# EAGLE design 5x5 Led Matrix (EAGLE 7.1.0)
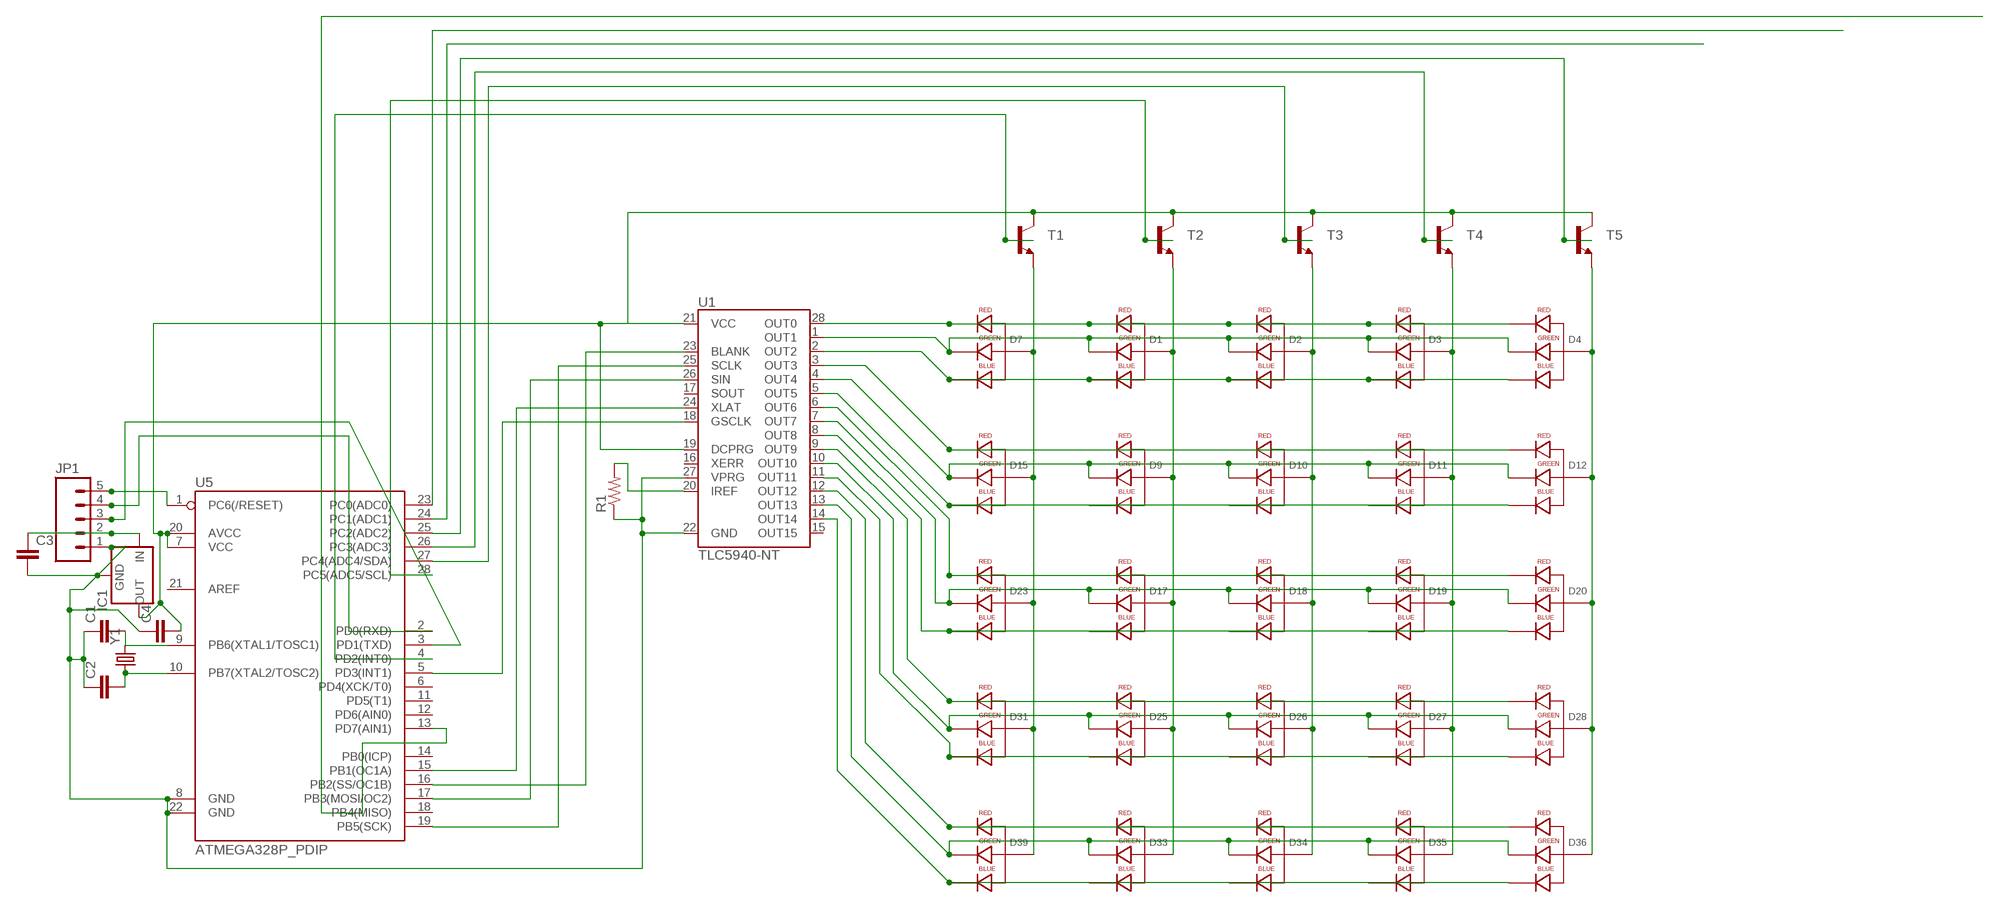
[diagram p0: schematic, sheet 1]

## Parts
C1  CAPPTH  [CAP-PTH-SMALL]
C2  CAPPTH  [CAP-PTH-SMALL]
C3  CAPPTH  [CAP-PTH-SMALL]
C4  CAPPTH  [CAP-PTH-SMALL]
D1  LED-RGB-CA-THRUDIFFUSE  [LED-RGB-THRU]
D2  LED-RGB-CA-THRUDIFFUSE  [LED-RGB-THRU]
D3  LED-RGB-CA-THRUDIFFUSE  [LED-RGB-THRU]
D4  LED-RGB-CA-THRUDIFFUSE  [LED-RGB-THRU]
D7  LED-RGB-CA-THRUCLEAR  [LED-RGB-THRU]
D9  LED-RGB-CA-THRUDIFFUSE  [LED-RGB-THRU]
D10  LED-RGB-CA-THRUDIFFUSE  [LED-RGB-THRU]
D11  LED-RGB-CA-THRUDIFFUSE  [LED-RGB-THRU]
D12  LED-RGB-CA-THRUDIFFUSE  [LED-RGB-THRU]
D15  LED-RGB-CA-THRUDIFFUSE  [LED-RGB-THRU]
D17  LED-RGB-CA-THRUDIFFUSE  [LED-RGB-THRU]
D18  LED-RGB-CA-THRUDIFFUSE  [LED-RGB-THRU]
D19  LED-RGB-CA-THRUDIFFUSE  [LED-RGB-THRU]
D20  LED-RGB-CA-THRUDIFFUSE  [LED-RGB-THRU]
D23  LED-RGB-CA-THRUDIFFUSE  [LED-RGB-THRU]
D25  LED-RGB-CA-THRUDIFFUSE  [LED-RGB-THRU]
D26  LED-RGB-CA-THRUDIFFUSE  [LED-RGB-THRU]
D27  LED-RGB-CA-THRUDIFFUSE  [LED-RGB-THRU]
D28  LED-RGB-CA-THRUCLEAR  [LED-RGB-THRU]
D31  LED-RGB-CA-THRUDIFFUSE  [LED-RGB-THRU]
D33  LED-RGB-CA-THRUDIFFUSE  [LED-RGB-THRU]
D34  LED-RGB-CA-THRUDIFFUSE  [LED-RGB-THRU]
D35  LED-RGB-CA-THRUDIFFUSE  [LED-RGB-THRU]
D36  LED-RGB-CA-THRUDIFFUSE  [LED-RGB-THRU]
D39  LED-RGB-CA-THRUDIFFUSE  [LED-RGB-THRU]
IC1  V_REG_78XXSIDE  [78XXL]
JP1  M05PTH  [1X05]
R1  RESISTORPTH-1/2W  [AXIAL-0.5]
T1  TRANSISTOR_NPN2N3904  [TO-92]
T2  TRANSISTOR_NPN2N3904  [TO-92]
T3  TRANSISTOR_NPN2N3904  [TO-92]
T4  TRANSISTOR_NPN2N3904  [TO-92]
T5  TRANSISTOR_NPN2N3904  [TO-92]
U1  TLC5940-NT  [DIL28-3]
U5  ATMEGA328P_PDIP  [DIL28-3]
Y1  CRYSTALHC49US  [HC49US]

## Nets
GND: C1.1 C2.1 C3.2 C4.1 IC1.GND JP1.1 R1.P$1 U1.22(GND) U1.27(VPRG) U5.8(GND) U5.22(GND)
N$1: D1.1(RED_CATHODE) D2.1(RED_CATHODE) D3.1(RED_CATHODE) D4.1(RED_CATHODE) D7.1(RED_CATHODE) U1.28(OUT0)
N$2: C1.2 U5.9(PB6(XTAL1/TOSC1)) Y1.2
N$3: C2.2 U5.10(PB7(XTAL2/TOSC2)) Y1.1
N$4: JP1.5 U5.1(PC6(/RESET))
N$5: JP1.4 U5.2(PD0(RXD))
N$6: JP1.3 U5.3(PD1(TXD))
N$10: D1.4(BLUE_CATHODE) D2.4(BLUE_CATHODE) D3.4(BLUE_CATHODE) D4.4(BLUE_CATHODE) D7.4(BLUE_CATHODE) U1.2(OUT2)
N$12: U1.25(SCLK) U5.19(PB5(SCK))
N$13: U1.26(SIN) U5.17(PB3(MOSI/OC2))
N$15: R1.P$2 U1.20(IREF)
N$16: U1.24(XLAT) U5.15(PB1(OC1A))
N$17: T5.2(B) U5.25(PC2(ADC2))
N$18: U1.18(GSCLK) U5.5(PD3(INT1))
N$19: U5.23(PC0(ADC0))
N$20: U5.24(PC1(ADC1))
N$21: T4.2(B) U5.26(PC3(ADC3))
N$22: T3.2(B) U5.27(PC4(ADC4/SDA))
N$23: T2.2(B) U5.28(PC5(ADC5/SCL))
N$24: T1.2(B) U5.4(PD2(INT0))
N$26: D1.3(GREEN_CATHODE) D2.3(GREEN_CATHODE) D3.3(GREEN_CATHODE) D4.3(GREEN_CATHODE) D7.3(GREEN_CATHODE) U1.1(OUT1)
N$27: U1.23(BLANK) U5.16(PB2(SS/OC1B))
N$32: U5.13(PD7(AIN1))
N$33: D9.1(RED_CATHODE) D10.1(RED_CATHODE) D11.1(RED_CATHODE) D12.1(RED_CATHODE) D15.1(RED_CATHODE) U1.3(OUT3)
N$34: D9.4(BLUE_CATHODE) D10.4(BLUE_CATHODE) D11.4(BLUE_CATHODE) D12.4(BLUE_CATHODE) D15.4(BLUE_CATHODE) U1.5(OUT5)
N$35: D9.3(GREEN_CATHODE) D10.3(GREEN_CATHODE) D11.3(GREEN_CATHODE) D12.3(GREEN_CATHODE) D15.3(GREEN_CATHODE) U1.4(OUT4)
N$38: D2.2(ANODE) D10.2(ANODE) D18.2(ANODE) D26.2(ANODE) D34.2(ANODE) T3.1(E)
N$44: D17.1(RED_CATHODE) D18.1(RED_CATHODE) D19.1(RED_CATHODE) D20.1(RED_CATHODE) D23.1(RED_CATHODE) U1.6(OUT6)
N$45: D17.4(BLUE_CATHODE) D18.4(BLUE_CATHODE) D19.4(BLUE_CATHODE) D20.4(BLUE_CATHODE) D23.4(BLUE_CATHODE) U1.8(OUT8)
N$46: D17.3(GREEN_CATHODE) D18.3(GREEN_CATHODE) D19.3(GREEN_CATHODE) D20.3(GREEN_CATHODE) D23.3(GREEN_CATHODE) U1.7(OUT7)
N$55: D25.1(RED_CATHODE) D26.1(RED_CATHODE) D27.1(RED_CATHODE) D28.1(RED_CATHODE) D31.1(RED_CATHODE) U1.9(OUT9)
N$56: D25.4(BLUE_CATHODE) D26.4(BLUE_CATHODE) D27.4(BLUE_CATHODE) D28.4(BLUE_CATHODE) D31.4(BLUE_CATHODE) U1.11(OUT11)
N$57: D25.3(GREEN_CATHODE) D26.3(GREEN_CATHODE) D27.3(GREEN_CATHODE) D28.3(GREEN_CATHODE) D31.3(GREEN_CATHODE) U1.10(OUT10)
N$61: C3.1 IC1.IN JP1.2
N$66: D33.1(RED_CATHODE) D34.1(RED_CATHODE) D35.1(RED_CATHODE) D36.1(RED_CATHODE) D39.1(RED_CATHODE) U1.12(OUT12)
N$67: D33.4(BLUE_CATHODE) D34.4(BLUE_CATHODE) D35.4(BLUE_CATHODE) D36.4(BLUE_CATHODE) D39.4(BLUE_CATHODE) U1.14(OUT14)
N$68: D33.3(GREEN_CATHODE) D34.3(GREEN_CATHODE) D35.3(GREEN_CATHODE) D36.3(GREEN_CATHODE) D39.3(GREEN_CATHODE) U1.13(OUT13)
N$80: D1.2(ANODE) D9.2(ANODE) D17.2(ANODE) D25.2(ANODE) D33.2(ANODE) T2.1(E)
N$106: D4.2(ANODE) D12.2(ANODE) D20.2(ANODE) D28.2(ANODE) D36.2(ANODE) T5.1(E)
N$107: D3.2(ANODE) D11.2(ANODE) D19.2(ANODE) D27.2(ANODE) D35.2(ANODE) T4.1(E)
N$109: D7.2(ANODE) D15.2(ANODE) D23.2(ANODE) D31.2(ANODE) D39.2(ANODE) T1.1(E)
VCC: C4.2 IC1.OUT T1.3(C) T2.3(C) T3.3(C) T4.3(C) T5.3(C) U1.19(DCPRG) U1.21(VCC) U5.7(VCC) U5.20(AVCC)
Unconnected: U1.15(OUT15) U1.16(XERR) U1.17(SOUT) U5.6(PD4(XCK/T0)) U5.11(PD5(T1)) U5.12(PD6(AIN0)) U5.14(PB0(ICP)) U5.18(PB4(MISO)) U5.21(AREF)

## Library data of the parts
C1 C2 = SparkFun-Capacitors:CAP: Capacitor Standard 0603 ceramic capacitor, and 0.1" leaded capacitor.
C3 C4 = SparkFun-Passives:CAP: Capacitor Standard 0603 ceramic capacitor, and 0.1" leaded capacitor.
D1-D4 D9-D12 D15 D17-D20 D23 D25-D27 D31 D33-D36 D39 = SparkFun-LED:LED-RGB-CA-THRU: RGB Through-hole common anode SparkFun store front COM-10821 (diffuse) COM-10820 (clear); PROD_ID: DIO-10632
D7 D28 = SparkFun-LED:LED-RGB-CA-THRU: RGB Through-hole common anode SparkFun store front COM-10821 (diffuse) COM-10820 (clear); PROD_ID: DIO-10631
IC1 = SparkFun-PowerIC:V_REG_78XX: Voltage Regulator Standard 7805 5V regulator. IGO (Input Ground Output). Spark Fun Electronics SKU : COM-00107
JP1 = SparkFun-Connectors:M05: Header 5 Standard 5-pin 0.1" header. Use with straight break away headers (SKU : PRT-00116), right angle break away headers (PRT-00553), swiss pins (PRT-00743), machine pins (PRT-00117), and female headers (PRT-00115). Molex polarized connector foot print use with SKU : PRT-08230 with associated crimp pins and housings.
R1 = SparkFun-Resistors:RESISTOR: Resistor Basic schematic elements and footprints for 0603, 1206, and PTH resistors.
T1-T5 = SparkFun-DiscreteSemi:TRANSISTOR_NPN: Generic NPN BJT MMBT2222A - TRANS-08049 (SOT-23, 1A 40V) MPSA42 - TRANS-09116 (SOT-23, 500mA 300V) MMBT5088LT1G - TRANS-11160 (SOT-23, 50 mA 30V) BC547 - COM-08928 <http://www.sparkfun.com/products/8928> (TO-92 45V 100mA) (1.Collector 2.Base 3.Emitter) 2N3904 - COM-00521 <http://www.sparkfun.com/products/521> (TO-92 40V 200mA) (1.Emitter 2.Base 3.Collector) P2N2222A - COM-12852 <http://www.sparkfun.com/products/12852> (TO-92 40V 600mA) (1.Collector 2.Base 3.Emitter); PROD_ID: TRANS-08447
U1 = SparkFun-DigitalIC:TLC5940: 16-channel LED Driver with Dot Correction and Grayscale PWM Control The TLC5940 is a 16-channel, constant-current sink LED driver. Each channel has an individually adjustable 4096-step grayscale PWM brightness control and a 64-step, constant-current sink (dot correction). The dot correction adjusts the brightness variations between LED channels and other LED drivers. The dot correction data is stored in an integrated EEPROM. Both grayscale control and dot correction are accessible via a serial interface. A single external resistor sets the maximum current value of all 16 channels. Packages: 28-pin HTSSOP 32-pin 5x5mm QFN 28-pin DIP
U5 = SparkFun-DigitalIC:ATMEGA328P_PDIP: uC used in the Arduino 32kb flash, 1k EEPROM, 2k SRAM This is the through-hole version of this chip.
Y1 = SparkFun-FreqCtrl:CRYSTAL: Various standard crystals. Proven footprints. Spark Fun Electronics SKU : COM-00534

## Board
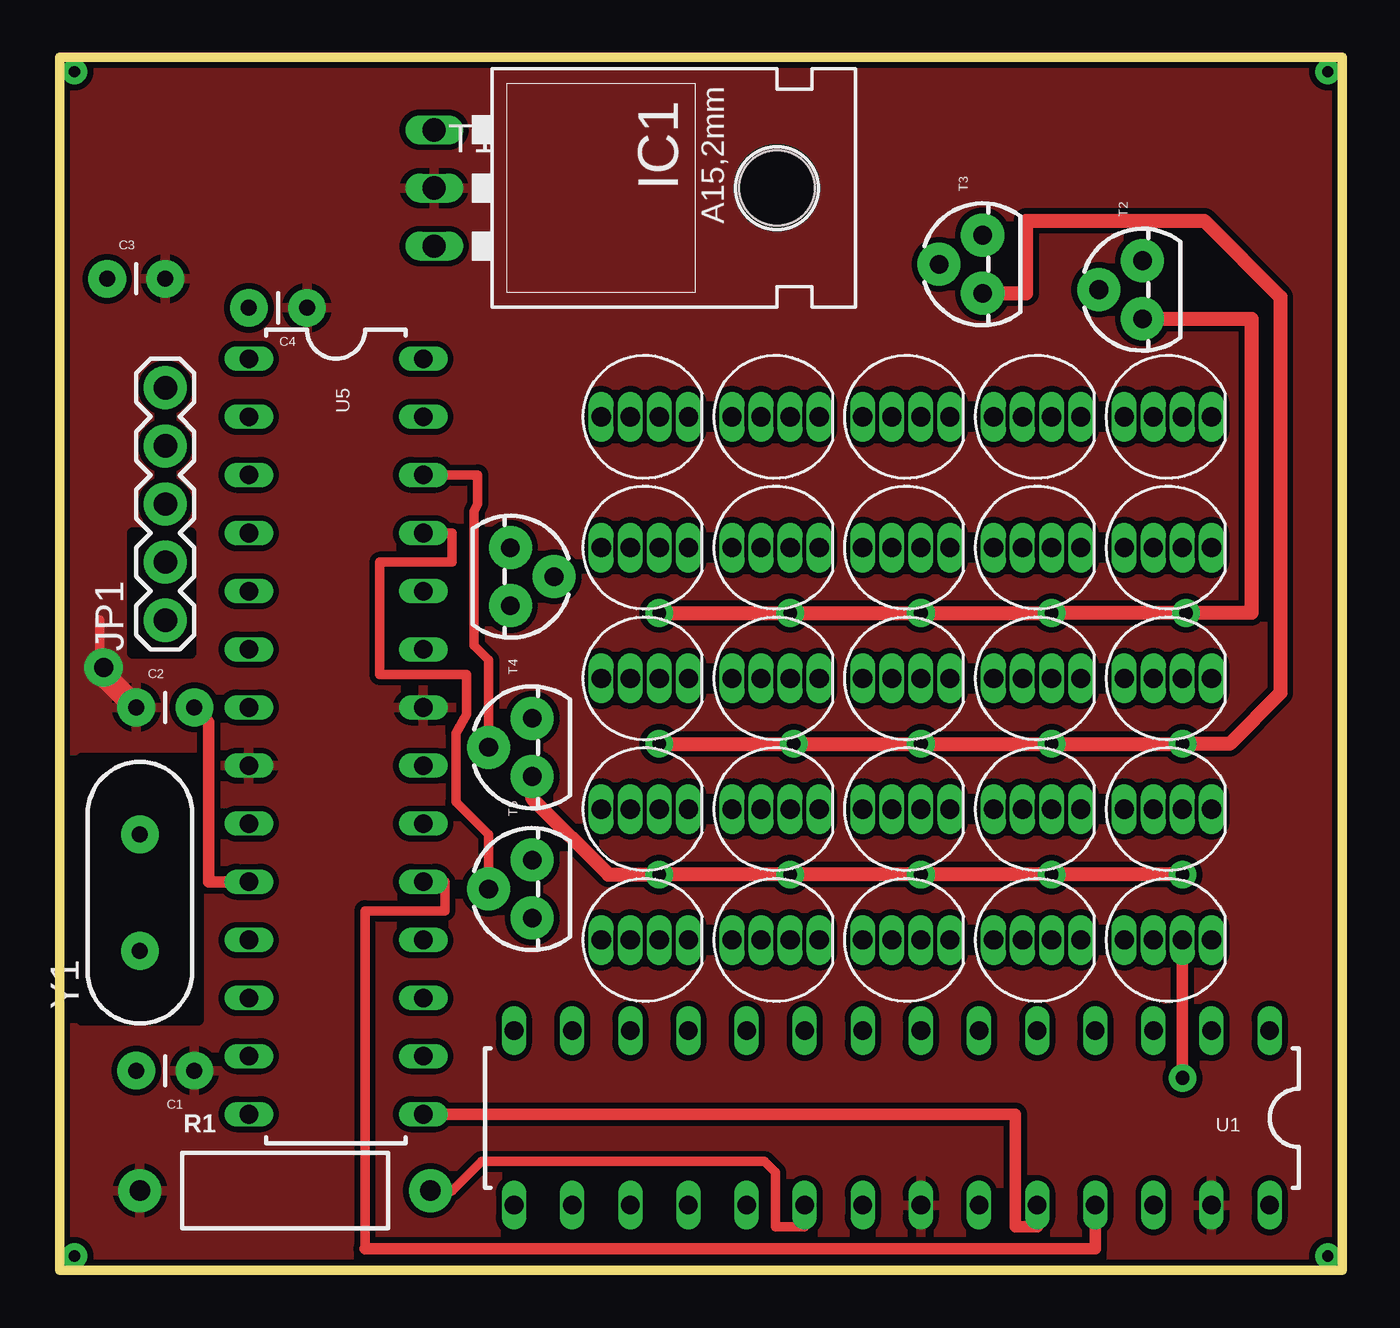
[diagram p1: board, top side]
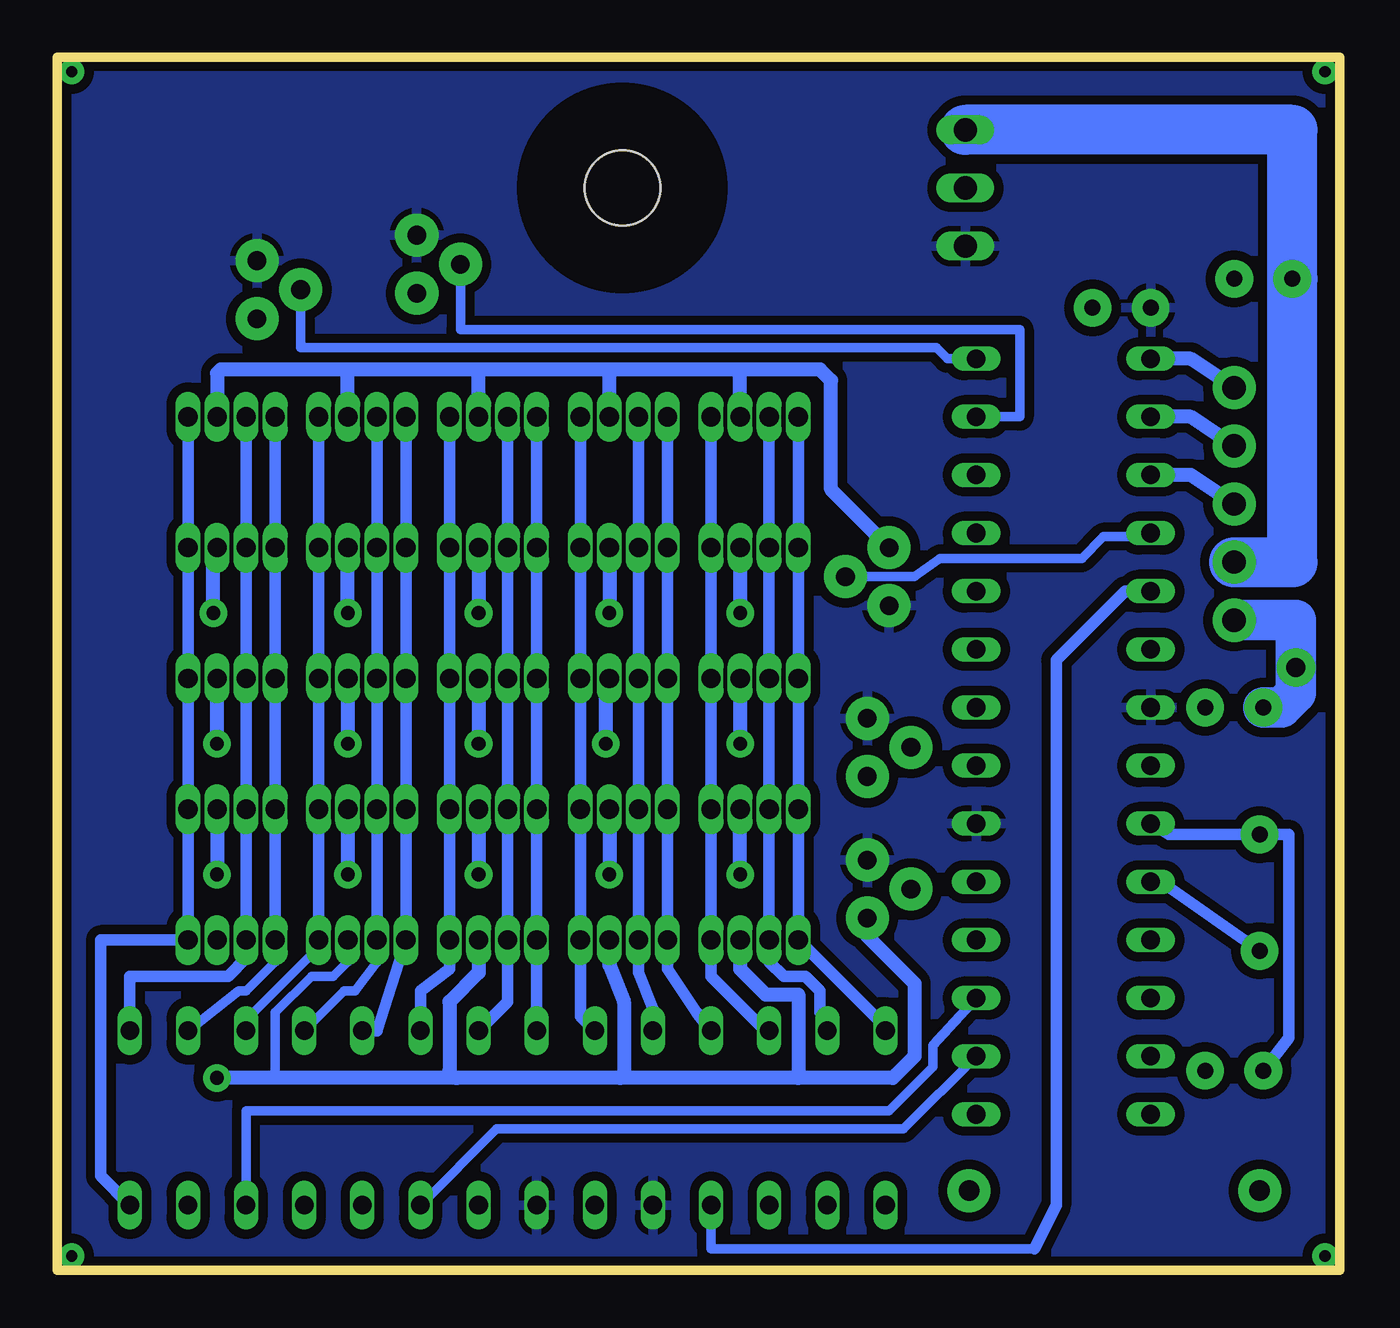
[diagram p2: board, bottom side, seen from below]

Size 56.04 x 53.02 mm. Coordinates in mm from the lower left corner, seen from the top.
Outline: 0,0 0,53.02 56.04,53.02 56.04,0 0,0
Copper layers (1*16): Top 0.035mm / dielectric 1.5mm / Bottom 0.035mm
Design rules "default *": minimum track width 12mil, minimum drill 0.34mm, track to track 6mil, track to pad 6mil, pad to pad 8mil, via to via 5mil, smd to smd 0mil, copper to edge 6mil, drill to drill 6mil, minimum pad ring 5mil, minimum via ring 12mil, stop-mask expansion 4mil, vias tented up to drill 0mil, thermal gap 10mil
tRestrict: area 3.3,12.5 to 5.9,20.2; area 1,11 to 6,22.4; area 3.2,27 to 5.7,32.2

### Footprints (pad centres in the part's own frame; a part is rotated, then mirrored left to right if it is on the bottom)
CAP-PTH-SMALL = drill 0.7 pad 1.651: 1 0,0; 2 2.54,0
LED-RGB-THRU = drill 0.838 pad 0.889 long: 1 1.905,0; 2 0.635,0; 3 -0.635,0; 4 -1.905,0
78XXL = drill 1.016 long: GND 0,-3.81; IN -2.54,-3.81; OUT 2.54,-3.81 | hole 3.302: 0,11.176
1X05 = drill 1.016 pad 1.88: 1 0,0; 2 2.54,0; 3 5.08,0; 4 7.62,0; 5 10.16,0
AXIAL-0.5 = drill 0.9 pad 1.88: P$1 -6.35,0; P$2 6.35,0
TO-92 = drill 0.813 pad 1.88: 1 -1.27,0; 2 0,1.905; 3 1.27,0
DIL28-3 = drill 0.813 long: 1 -16.51,-3.81; 2 -13.97,-3.81; 3 -11.43,-3.81; 4 -8.89,-3.81; 5 -6.35,-3.81; 6 -3.81,-3.81; 7 -1.27,-3.81; 8 1.27,-3.81; 9 3.81,-3.81; 10 6.35,-3.81; 11 8.89,-3.81; 12 11.43,-3.81; 13 13.97,-3.81; 14 16.51,-3.81; 15 16.51,3.81; 16 13.97,3.81; 17 11.43,3.81; 18 8.89,3.81; 19 6.35,3.81; 20 3.81,3.81; 21 1.27,3.81; 22 -1.27,3.81; 23 -3.81,3.81; 24 -6.35,3.81; 25 -8.89,3.81; 26 -11.43,3.81; 27 -13.97,3.81; 28 -16.51,3.81
HC49US = drill 0.7 pad 1.651: 1 -2.54,0; 2 2.54,0

### Placement (x,y rotation side)
C1  5.87,8.73 180 top
C2  3.33,24.61 0 top
C3  2.06,43.34 0 top
C4  10.79,42.07 180 top
D1  48.42,31.59 0 top
D2  48.42,25.88 0 top
D3  48.42,20.16 0 top
D4  48.42,14.45 0 top
D7  48.42,37.31 0 top
D9  42.7,31.59 0 top
D10  42.7,25.88 0 top
D11  42.7,20.16 0 top
D12  42.7,14.45 0 top
D15  42.7,37.31 0 top
D17  36.99,31.59 0 top
D18  36.99,25.88 0 top
D19  36.99,20.16 0 top
D20  36.99,14.45 0 top
D23  36.99,37.31 0 top
D25  31.27,31.59 0 top
D26  31.27,25.88 0 top
D27  31.27,20.16 0 top
D28  31.27,14.45 0 top
D31  31.27,37.31 0 top
D33  25.56,31.59 0 top
D34  25.56,25.88 0 top
D35  LED-RGB-CA-THRUCLEAR  [LED-RGB-THRU]  25.56,20.16 0 top
D36  25.56,14.45 0 top
D39  25.56,37.31 0 top
DRILEGEND  [DRILEGEND]  -0.08,-11.66 0 top  (outside the outline)
IC1  20.16,47.31 270 top
JP1  4.6,28.42 90 top
R1  9.84,3.49 0 top
T1  19.69,30.32 270 top
T2  47.31,42.86 90 top
T3  40.32,43.97 90 top
T4  20.64,22.86 90 top
T5  20.64,16.67 90 top
U1  36.35,6.67 180 top
U5  12.06,23.34 270 top
Y1  3.49,16.51 90 top

### Tracks (layer width: path | path; a pad name or v marks a point on that pad's centre or on a via)
GND  (via drill 0.84 pad 1.68)
  Top 0.406: 1.75,28.42 1.75,26.19
  Top 1.016: 1.75,26.19 C2.1
  Bottom 1.778: JP1.1 1.91,28.42 v1.91,26.35 1.91,25.24 2.54,24.61 C2.1
  pour Top (isolate 0.254): 0,53.02 56.04,53.02 56.04,0 0,0
N$1
  Bottom 0.508: D7.1 D1.1 D2.1 D3.1 D4.1 54.13,14.45 54.13,4.13 U1.28
N$2
  Bottom 0.508: U5.9 7.46,19.05 Y1.2 2.22,19.05 2.22,10.16 C1.2
N$3
  Top 0.508: C2.2 6.51,23.97 6.51,16.99 U5.10
  Bottom 0.508: U5.10 7.78,16.99 Y1.1
N$4
  Bottom 0.61: JP1.5 6.51,39.85 U5.1
N$5
  Bottom 0.61: JP1.4 6.51,37.31 U5.2
N$6
  Bottom 0.61: JP1.3 6.51,34.77 U5.3
N$10
  Bottom 0.406: D4.4 46.51,13.49 47.78,12.22 48.1,12.22 U1.2
  Bottom 0.508: D4.4 D3.4 D2.4 D1.4 D7.4
N$12
  Top 0.406: 13.33,0.95 13.33,15.72 16.83,15.72 16.83,16.99 U5.19
  Top 0.508: U1.25 45.24,0.95 13.33,0.95
N$13
  Bottom 0.406: U1.26 47.78,6.98 19.69,6.98 17.78,8.89 17.78,9.84 U5.17
N$15
  Top 0.406: R1.P$2 17.15,3.49 18.42,4.76 30.8,4.76 31.27,4.29 31.27,1.9 32.54,1.9 U1.20
N$16
  Top 0.508: U5.15 41.75,6.83 41.75,1.9 42.7,1.9 U1.24
N$17
  Top 0.406: U5.25 17.15,32.23 17.15,30.96 13.97,30.96 13.97,26.03 17.78,26.03 17.78,24.29 17.3,23.49 17.3,20.48 18.73,19.05 T5.2
N$18
  Bottom 0.406: 13.33,0.95 27.46,0.95 U1.18
  Bottom 0.508: U5.5 9.37,29.69 12.38,26.67 12.38,2.86 13.33,0.95
N$21
  Top 0.406: U5.26 18.26,34.77 18.26,33.5 18.1,33.18 18.1,27.3 18.73,26.67 T4.2
N$22
  Bottom 0.406: T3.2 38.42,41.12 13.97,41.12 13.97,37.31 U5.27
N$23
  Bottom 0.406: T2.2 45.4,40.32 18.26,40.32 17.62,40.32 17.15,39.85 U5.28
N$24
  Bottom 0.406: U5.4 8.41,32.07 10.32,32.07 11.27,31.11 17.46,31.11 18.57,30.32 T1.2
N$26
  Bottom 0.508: D7.3 D1.3 D2.3 D3.3 D4.3 47.78,13.65 48.58,12.86 52.86,12.86 U1.1
N$27
  Bottom 0.406: U5.16 19.05,6.19 36.83,6.19 U1.23
N$30  (via drill 0.5)
  other vias: 55.4,52.39
N$31  (via drill 0.5)
  other vias: 55.4,0.63
N$33
  Bottom 0.406: D12.1 44.61,14.13 47.78,10.95 U1.3
  Bottom 0.508: D15.1 D9.1 D10.1 D11.1 D12.1
N$34
  Bottom 0.508: D15.4 D9.4 D10.4 D11.4 D12.4 42.07,10.48 U1.5
N$35
  Bottom 0.406: D12.3 42.07,13.49 43.02,12.22 43.5,12.22 U1.4
  Bottom 0.508: D12.3 D11.3 D10.3 D9.3 D15.3
N$36  (via drill 0.5)
  other vias: 0.64,0.63
N$37  (via drill 0.5)
  other vias: 0.64,52.39
N$38  (via drill 0.6)
  Top 0.61: T3.1 42.23,42.7 42.23,45.88 50.01,45.88 53.34,42.54 53.34,25.24 51.12,23.02 v49.05,23.02 v43.34,23.02 v37.62,23.02 v32.07,23.02 v26.19,23.02
  Bottom 0.61: v49.05,23.02 D2.2 | D10.2 v43.34,23.02 | D18.2 v37.62,23.02 | D26.2 32.07,25.88 v32.07,23.02 | D34.2 v26.19,23.02
N$44
  Bottom 0.508: D23.1 D17.1 D18.1 D19.1 D20.1 38.89,13.18 40.16,12.22 U1.6
N$45
  Bottom 0.508: D23.4 D17.4 D18.4 D19.4 D20.4 U1.8
N$46
  Bottom 0.508: D23.3 D17.3 D18.3 D19.3 D20.3 36.35,11.75 U1.7
N$55
  Bottom 0.508: D31.1 D25.1 D26.1 D27.1 D28.1 33.18,11.11 U1.9
N$56
  Bottom 0.508: D31.4 D25.4 D26.4 D27.4 D28.4 29.37,13.18 28.1,11.27 U1.11
N$57
  Bottom 0.508: D31.3 D25.3 D26.3 D27.3 D28.3 30.64,13.02 30,11.43 U1.10
N$61
  Bottom 2.184: JP1.2 2.06,30.96 C3.1 2.06,49.85 IC1.IN
N$66
  Bottom 0.508: D39.1 D33.1 D34.1 D35.1 D36.1 27.46,12.86 24.92,10.32 U1.12
N$67
  Bottom 0.508: D39.4 D33.4 D34.4 D35.4 D36.4 19.84,10.64 U1.14
N$68
  Bottom 0.508: D39.3 D33.3 D34.3 D35.3 D36.3 24.92,13.49 24.29,12.86 23.81,12.86 23.34,12.86 22.7,12.22 22.7,11.27 22.38,10.95 U1.13
N$80  (via drill 0.6)
  Top 0.61: T2.1 52.07,41.59 52.07,28.73 v49.21,28.73 v43.34,28.73 v37.62,28.73 v31.91,28.73 v26.19,28.73
  Bottom 0.61: v49.21,28.73 49.21,31.59 D1.2 | v43.34,28.73 D9.2 | D17.2 v37.62,28.73 | D25.2 v31.91,28.73 | D33.2 v26.19,28.73
N$106  (via drill 0.6)
  Top 0.508: v49.05,8.41 D4.2
  Bottom 0.406: v49.05,8.41 46.51,8.41 46.51,11.27 44.93,12.86 43.97,12.86 43.34,13.49 D12.2
  Bottom 0.61: 23.65,8.41 19.53,8.41 18.57,9.37 18.57,12.54 20.64,14.6 T5.1 | 23.65,8.41 31.43,8.41 | 31.43,8.41 38.58,8.41 | 38.58,8.41 v49.05,8.41 | D20.2 37.62,13.02 38.89,11.75 38.89,8.73 arc-90 38.58,8.41 | D28.2 31.91,13.33 31.27,11.75 31.27,8.57 31.43,8.41 | D36.2 26.19,13.18 25.08,12.06 23.65,12.06 23.65,8.41
N$107  (via drill 0.6)
  Top 0.61: T4.1 20.64,20.64 23.97,17.3 v26.19,17.3 v31.91,17.3 v37.62,17.3 v43.34,17.3 v49.05,17.3
  Bottom 0.61: v26.19,17.3 D35.2 | D27.2 v31.91,17.3 | D19.2 v37.62,17.3 | D11.2 v43.34,17.3 | D3.2 v49.05,17.3
N$109
  Bottom 0.61: T1.1 22.22,34.13 22.22,38.89 22.7,39.37 26.19,39.37 | 26.19,39.37 31.91,39.37 | 31.91,39.37 37.62,39.37 | 37.62,39.37 43.34,39.37 | 43.34,39.37 48.9,39.37 49.05,39.21 D7.2 | D15.2 43.34,39.37 | D23.2 37.62,39.37 | D31.2 31.91,39.37 | D39.2 26.19,39.37
VCC
  pour Bottom (isolate 0.406): 0,53.02 56.04,53.02 56.04,0 0,0